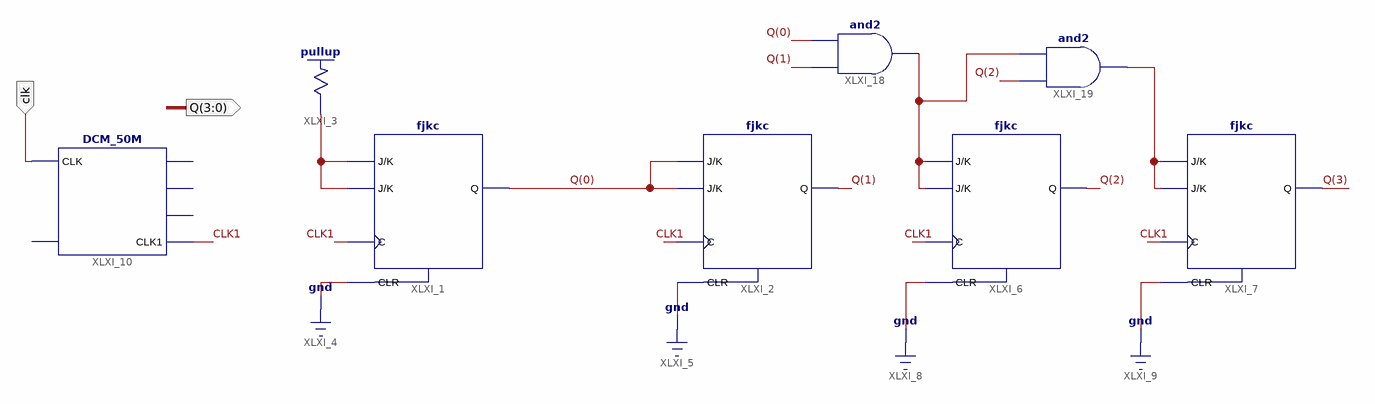
[diagram p0: schematic sheet 1]
// Xilinx ISE schematic Exp5.sch (spartan3e) as structural Verilog: 8 symbols, 2 ports
module Exp5 (
  input  clk,
  output [3:0] Q
);

  wire CLK1, XLXN_1, XLXN_61, XLXN_62;

  fjkc XLXI_1 (.C(CLK1), .CLR(1'b0), .J(XLXN_1), .K(XLXN_1), .Q(Q[0]));
  fjkc XLXI_2 (.C(CLK1), .CLR(1'b0), .J(Q[0]), .K(Q[0]), .Q(Q[1]));
  \pullup  XLXI_3 (.O(XLXN_1));
  fjkc XLXI_6 (.C(CLK1), .CLR(1'b0), .J(XLXN_61), .K(XLXN_61), .Q(Q[2]));
  fjkc XLXI_7 (.C(CLK1), .CLR(1'b0), .J(XLXN_62), .K(XLXN_62), .Q(Q[3]));
  DCM_50M XLXI_10 (.CLK(clk), .CLK1(CLK1));  // open: RST, CLK1M, CLK10k, CLK1k
  and XLXI_18 (XLXN_61, Q[1], Q[0]);
  and XLXI_19 (XLXN_62, Q[2], XLXN_61);
endmodule
